# Altium schematic sheet SWP_SmartCard_NFC.SchDoc: SWP_SmartCard_NFC
size A3; DocumentNumber: MB1144; Revision: C-02; SheetNumber: 8; SheetTotal: 25; Project: STM32L476G-EVAL; ModifiedDate: 9/23/2015
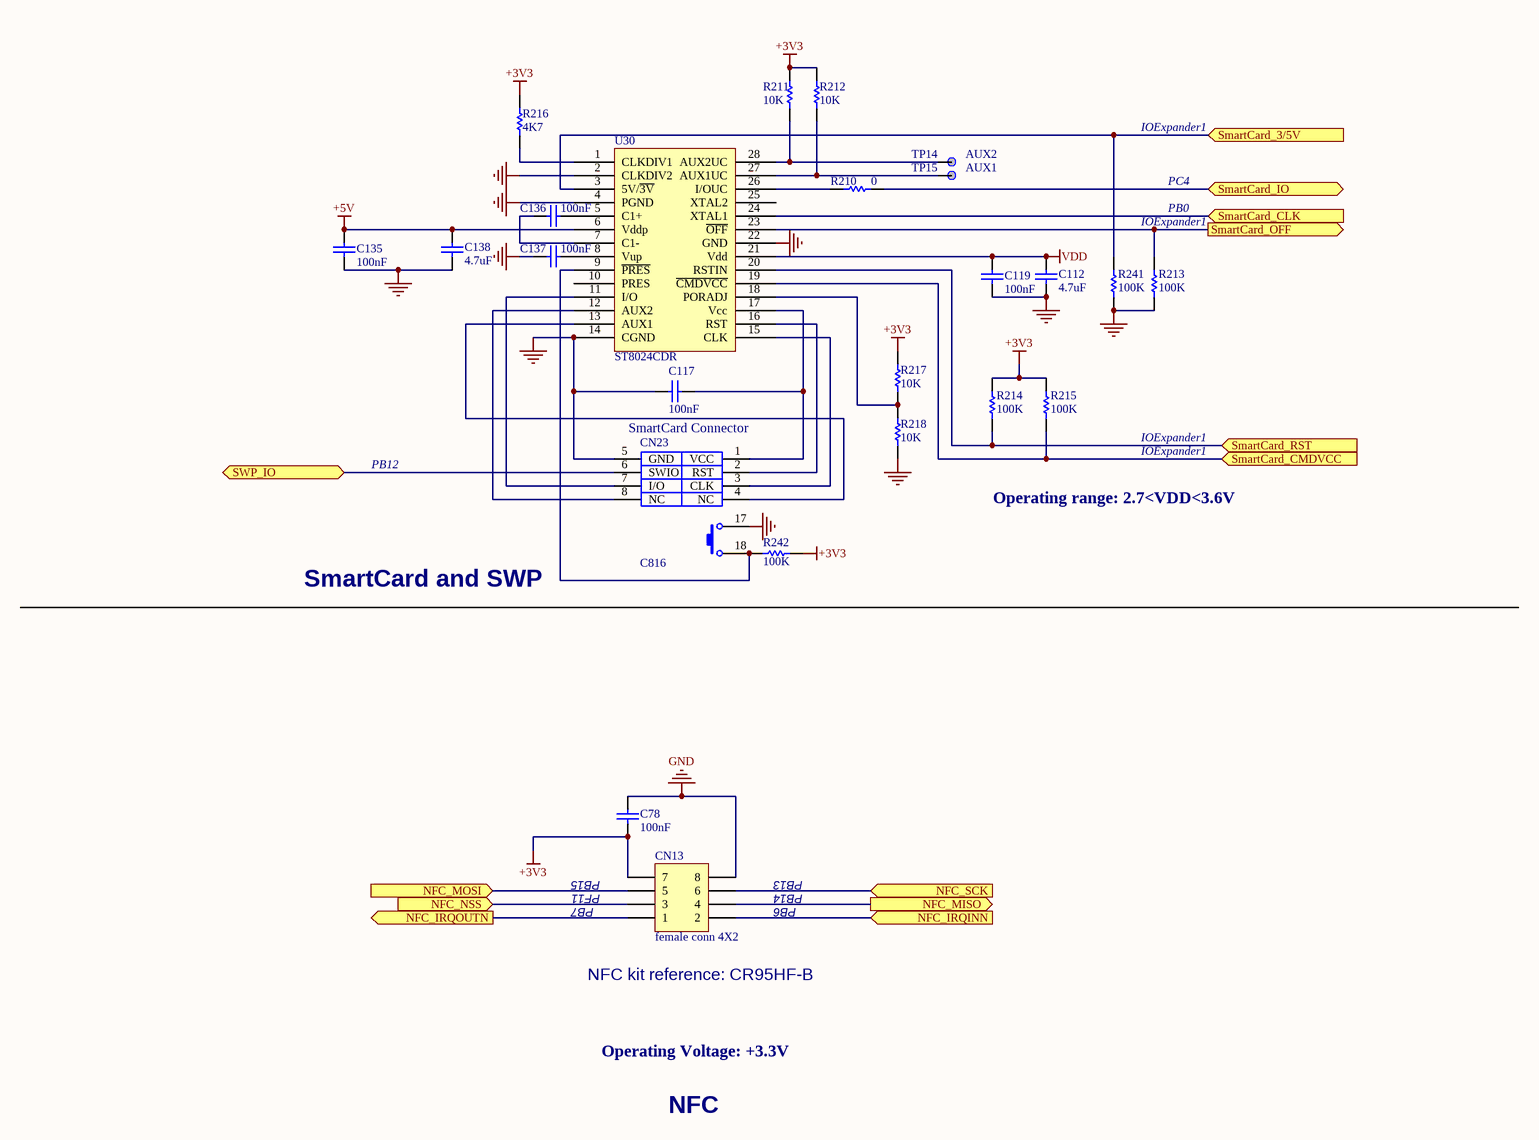
[diagram p0: SWP_SmartCard_NFC.SchDoc]

## Parts
C78  100nF  [0402C]
C112  4.7uF  [0603C]
C117  100nF  [0402C]
C119  100nF  [0402C]
C135  100nF  [0402C]
C136  100nF  [0402C]
C137  100nF  [0402C]
C138  4.7uF  [0603C]
CN13  female conn 4X2  [HDR_2X4_2R54_N]
CN23  C816  [sam_c816]
R210  0  [0603R]
R211  10K  [0402R]
R212  10K  [0402R]
R213  100K  [0402R]
R214  100K  [0402R]
R215  100K  [0402R]
R216  4K7  [0402R]
R217  10K  [0402R]
R218  10K  [0402R]
R241  100K  [0402R]
R242  100K  [0402R]
TP14  TP Name: AUX2  [TP]  (hidden comment: [N/A])
TP15  TP Name: AUX1  [TP]  (hidden comment: [N/A])
U30  ST8024CDR  [SOIC28W_1R27_17R9X10R325]

## Ports
NFC_IRQINN (in), NFC_IRQOUTN (out), NFC_MISO (out), NFC_MOSI (in), NFC_NSS (in), NFC_SCK (in), SmartCard_3/5V (in), SmartCard_CLK (in), SmartCard_CMDVCC (in), SmartCard_IO (bidir), SmartCard_OFF (out), SmartCard_RST (in), SWP_IO (bidir)

## Nets
+3V3: C78.2 CN13.7 R211.1 R212.1 R214.1 R215.1 R216.1 R217.1 R242.1
+5V: C135.1 C138.1 U30.6(Vddp)
GND: C78.1 C112.2 C117.1 C119.2 C135.2 C137.2 C138.2 CN13.8 CN23.5(GND) CN23.17 R213.2 R218.2 R241.2 U30.2(CLKDIV2) U30.4(PGND) U30.14(CGND) U30.22(GND)
VDD: C112.1 C119.1 U30.21(Vdd)
NFC_IRQINN: CN13.2 ; port NFC_IRQINN
NFC_IRQOUTN: CN13.1 ; port NFC_IRQOUTN
NFC_MISO: CN13.4 ; port NFC_MISO
NFC_MOSI: CN13.5 ; port NFC_MOSI
NFC_NSS: CN13.3 ; port NFC_NSS
NFC_SCK: CN13.6 ; port NFC_SCK
SmartCard_3/5V: R241.1 U30.3(5V/~{3V}) ; port SmartCard_3/5V
SmartCard_CLK: U30.24(XTAL1) ; port SmartCard_CLK
SmartCard_CMDVCC: R215.2 U30.19(~{CMDVCC}) ; port SmartCard_CMDVCC
SmartCard_IO: R210.2 ; port SmartCard_IO
SmartCard_OFF: R213.1 U30.23(~{OFF}) ; port SmartCard_OFF
SmartCard_RST: R214.2 U30.20(RSTIN) ; port SmartCard_RST
SWP_IO: CN23.6(SWIO) ; port SWP_IO
NetC117_2: C117.2 CN23.1(VCC) U30.17(Vcc)
NetC136_1: C136.1 U30.7(C1-)
NetC136_2: C136.2 U30.5(C1+)
NetC137_1: C137.1 U30.8(Vup)
NetCN23_2: CN23.2(RST) U30.16(RST)
NetCN23_3: CN23.3(CLK) U30.15(CLK)
NetCN23_4: CN23.4(NC) U30.13(AUX1)
NetCN23_7: CN23.7(I/O) U30.11(I/O)
NetCN23_8: CN23.8(NC) U30.12(AUX2)
NetCN23_18: CN23.18 R242.2 U30.9(~{PRES})
NetR210_1: R210.1 U30.26(I/OUC)
NetR211_2: R211.2 TP14.1 U30.28(AUX2UC)
NetR212_2: R212.2 TP15.1 U30.27(AUX1UC)
NetR216_2: R216.2 U30.1(CLKDIV1)
NetR217_2: R217.2 R218.1 U30.18(PORADJ)

Not connected (* = marked no-connect by the designer): U30 10(PRES) 25(XTAL2)

## Notes on the sheet
- IOExpander1
- PC4
- PB0
- (near CN23) SmartCard Connector
- PB12
- Operating range: 2.7<VDD<3.6V
- SmartCard and SWP
- PB7
- PB15
- PF11
- PB6
- PB14
- PB13
- (near CN13) NFC kit reference: CR95HF-B
- Operating Voltage: +3.3V
- NFC
- Title:
- Project:
- Size:
- Date:
- A3
- Reference:
- Sheet:
- Revision:
- of

## Library data of the parts
C78 = CAP: Capacitor; Value: 100pF; Ordered by: Subcon; ECCN_US/EU: NA; Published: 8-Jun-2000; Revision: July-2002: Re-released for DXP Platform.; Publisher: Altium Limited
C112 C138 = Cap: Capacitor; Value: 10nF; Ordered by: Subcon; ECCN_US/EU: NA; Published: 8-Jun-2000; Revision: July-2002: Re-released for DXP Platform.; Publisher: Altium Limited
C117 C119 C135-C137 = CAP: Capacitor; Ordered by: Subcon; ECCN_US/EU: NA; Published: 8-Jun-2000; Revision: July-2002: Re-released for DXP Platform.; Publisher: Altium Limited; Value: 100nF
CN13 = female conn 4X2: female conn 4X2 4-Pin, Dual row; Ordered by: Subcon; ECCN_US/EU: NA; Comments: NFC connector; Revision: 17-Jul-2002: Re-released for DXP Platform.; Publisher: Altium Limited
CN23 = Smart_card_CN: Ordered by: Subcon; Comments: Smartcard "GSM file and SWP" conenctor; ECCN_US/EU: NA; Assembly: with ST smartcard 8000080
R210-R218 R241 R242 = Res1: Resistor; Value: 1K; Ordered by: Subcon; ECCN_US/EU: NA; Published: 8-Jun-2000; Revision: July-2002: Re-released for DXP Platform.; Publisher: Altium Limited
TP14 TP15 = TP: Ordered by: Subcon; Fitted or not fitted: NO; ECCN_US/EU: NA; Fitted: NO
U30 = ST8024CTR: Ordered by: ST; ECCN_US/EU: EAR99/NEC; Ref St: 9177802; Manuf_1: ST; Manuf_Part_1: ST8024CDR